# Altium schematic sheet motor2_control.SchDoc
size B; SheetNumber: 4; SheetTotal: 4
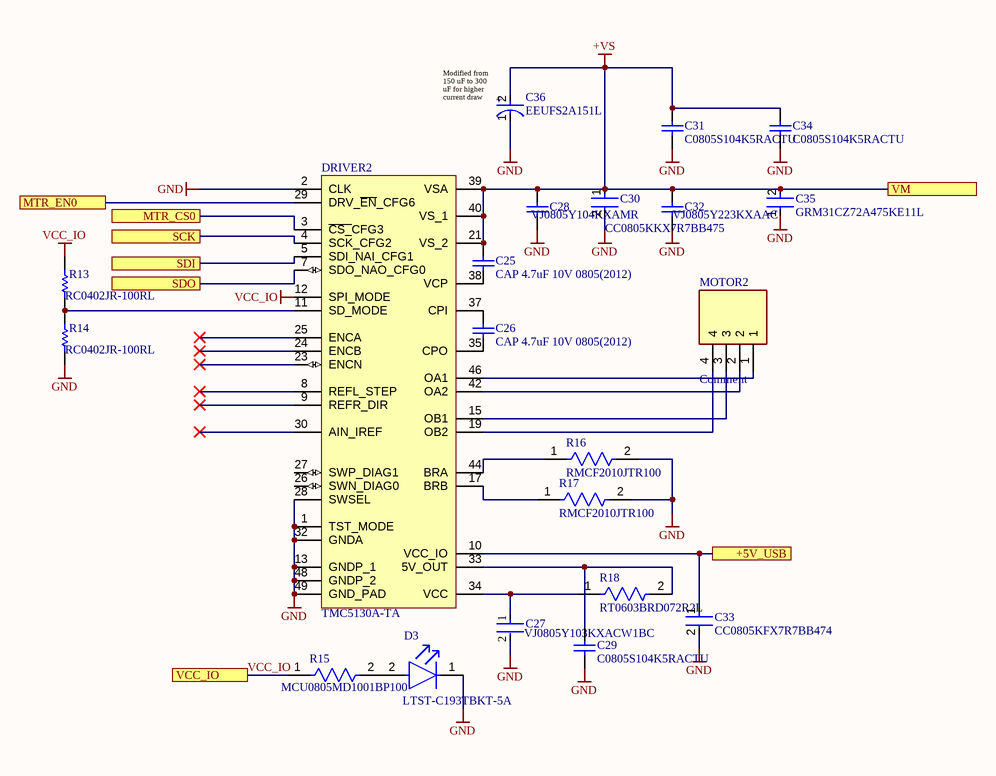
[diagram p0: motor2_control.SchDoc]

## Parts
C25  CAP 4.7uF 10V 0805(2012)  [CAPC0805(2012)155_L]
C26  CAP 4.7uF 10V 0805(2012)  [CAPC0805(2012)155_L]
C27  VJ0805Y103KXACW1BC  [FP-VJ0805-MFG]
C28  VJ0805Y104KXAMR  [CAPC2013X145X48NL20T23]
C29  C0805S104K5RACTU  [CAPC2013X145X50NL20T25]
C30  CC0805KKX7R7BB475  [FP-CC0805-0_85-MFG]
C31  C0805S104K5RACTU  [CAPC2013X145X50NL20T25]
C32  VJ0805Y223KXAAC  [CAPC2013X145X48NL20T23]
C33  CC0805KFX7R7BB474  [FP-CC0805-0_85-MFG]
C34  C0805S104K5RACTU  [CAPC2013X145X50NL20T25]
C35  GRM31CZ72A475KE11L  [FP-GRM31C-0_3-e0_3_0_9-MFG]
C36  EEUFS2A151L  [FP-RAD-TH-D_10_0_5-L_25_2-MFG]
D3  LTST-C193TBKT-5A  [FP-LTST-C193TBKT-5A-MFG]
DRIVER2  TMC5130A-TA  [TMC5130_TQFP48-EP_0.5_7.0X7.0]
MOTOR2  Comment  [TE_282834-4]
R13  RC0402JR-100RL  [RESC1005X40X25NL05T10]
R14  RC0402JR-100RL  [RESC1005X40X25NL05T10]
R15  MCU0805MD1001BP100  [FP-MCU0805-IPC_A]
R16  RMCF2010JTR100  [FP-RMCF2010-IPC_B]
R17  RMCF2010JTR100  [FP-RMCF2010-IPC_B]
R18  RT0603BRD072R2L  [FP-RT0603-MFG]

## Ports
+5V_USB, MTR_CS0, MTR_EN0, SCK, SDI, SDO, VCC_IO, VM

## Nets
+VS: C25.2 C28.2 C30.1 C31.2 C32.2 C34.2 C35.2 C36.2(A) DRIVER2.21(VS_2) DRIVER2.39(VSA) DRIVER2.40(VS_1) ; port VM
GND: C27.2 C28.1 C29.1 C30.2 C31.1 C32.1 C33.2 C34.1 C35.1 C36.1(C) D3.1(C) DRIVER2.1(TST_MODE) DRIVER2.2(CLK) DRIVER2.13(GNDP_1) DRIVER2.28(SWSEL) DRIVER2.32(GNDA) DRIVER2.48(GNDP_2) DRIVER2.49(GND_PAD) R14.2 R16.2 R17.2
VCC_IO: DRIVER2.12(SPI_MODE) R13.1 R15.1 ; port VCC_IO
+5V_USB: C33.1 DRIVER2.10(VCC_IO) ; port +5V_USB
MTR_CS0: DRIVER2.3(~{CS_}CFG3) ; port MTR_CS0
MTR_EN0: DRIVER2.29(DRV_~{EN}_CFG6) ; port MTR_EN0
SCK: DRIVER2.4(SCK_CFG2) ; port SCK
SDI: DRIVER2.5(SDI_NAI_CFG1) ; port SDI
SDO: DRIVER2.7(SDO_NAO_CFG0) ; port SDO
NetC25_1: C25.1 DRIVER2.38(VCP)
NetC26_1: C26.1 DRIVER2.35(CPO)
NetC26_2: C26.2 DRIVER2.37(CPI)
NetC27_1: C27.1 DRIVER2.34(VCC) R18.1
NetC29_2: C29.2 DRIVER2.33(5V_OUT) R18.2
NetD3_2: D3.2(A) R15.2
NetDRIVER2_11: DRIVER2.11(SD_MODE) R13.2 R14.1
NetDRIVER2_15: DRIVER2.15(OB1) MOTOR2.3
NetDRIVER2_17: DRIVER2.17(BRB) R17.1
NetDRIVER2_19: DRIVER2.19(OB2) MOTOR2.4
NetDRIVER2_42: DRIVER2.42(OA2) MOTOR2.2
NetDRIVER2_44: DRIVER2.44(BRA) R16.1
NetDRIVER2_46: DRIVER2.46(OA1) MOTOR2.1

Not connected (* = marked no-connect by the designer): DRIVER2 8(REFL_STEP)* 9(REFR_DIR)* 23(ENCN)* 24(ENCB)* 25(ENCA)* 26(SWN_DIAG0) 27(SWP_DIAG1) 30(AIN_IREF)*

## Notes on the sheet
- (near C36) Modified from 150 uF to 300 uF for higher current draw
- (in symbol CMP-05427-000502-1) +

## Library data of the parts
C25 C26 = CMP-1036-04882-1: CAP 4.7uF 10V ±10% 0805 (2012 Metric) Thickness 1.55mm SMD; Case-EIA: 0805; Tolerance: Â±10%; Case-Metric: 2012; Rated Voltage: 10 V; Max Thickness: 1.55 mm; Technology: SMT; Value: 4.7uF
C27 = CMP-2007-03438-2: NexarPartId: 39476146; Dielectric: X7R; Tolerance: 10%; Voltage: 50V; Dielectric Material: Tantalum; Capacitance: 10nF; Case Code (Imperial): 0805; Case Code (Metric): 2012; Schedule B: 8532240020, 8532240020; Radiation Hardening: No; Packaging: Cut Tape; Thickness: 939.8µm; Width: 1.2446mm; Lead Free: Lead Free; RoHS: Compliant; Depth: 1.25mm; Number of Pins: 2; Mount: Surface Mount; Case/Package: 0805; Length: 2mm; Termination: SMD/SMT; Max Operating Temperature: 125°C; REACH SVHC: Unknown; Min Operating Temperature: -55°C; Voltage Rating: 50V; Height: 1.45mm; Voltage Rating (DC): 50V
C28 = CMP-2007-01705-1: Manufacturer: Vitramon; Part Number: VJ0805Y104KXAMR
C29 C31 C34 = CMP-2007-01227-1: Manufacturer: Kemet; Part Number: C0805S104K5RACTU
C30 = CMP-03422-000207-1: CAP CER 4.7UF 16V X7R 0805; Manufacturer: Yageo; Tolerance: 0.1; Material: Ceramic; Footprint Url: http://www.yageo.com/exep/pages/download/literatures/UPY-C_GEN_24.pdf; Device Class L3: Ceramic Capacitors; Temperature: -30°C to +85°C; Device Class L2: Capacitors; Automotive: No; Digikey Description: CAP CER 4.7UF 16V X7R 0805; Temperature Range High: +85°C; Lead Free: Yes; Mouser Description: Multilayer Ceramic Capacitors MLCC - SMD/SMT 4.7M pF 10% 16 Volts; Temperature Characteristic: X7R; Height: 0.95mm; Device Class L1: Passive Components; ComponentLink2Description: Datasheet; Category: Cap; Octopart: https://octopart.com/cc0805kkx7r7bb475-yageo-34429188; Temperature Range Low: -30°C; Manufacturer Part Number: CC0805KKX7R7BB475; Package: CC0805-0.85; Ipc Land Pattern Name: CAPC200125X85; RoHS: TRUE; Value: 4.7 uF; Capacitance: 4.7 uF; ComponentLink2URL: http://www.yageo.com/documents/recent/UPY-GPHC_Y5V_6.3V-to-50V_8.pdf; Voltage Rating: 16 V
C32 = CMP-2007-01723-1: Manufacturer: Vitramon; Part Number: VJ0805Y223KXAAC
C33 = CMP-03422-001203-1: CC0805 470 nF X7R 10.00% 16 V; Manufacturer: Yageo; Tolerance: 0.1; Voltage Rating: 16 V; Value: 470 nF; Material: Ceramic; Device Class L1: Passive Components; Footprint Url: http://www.yageo.com/exep/pages/download/literatures/UPY-C_GEN_24.pdf; Temperature Range Low: -30°C; Octopart: https://octopart.com/cc0805kfx7r7bb474-yageo-24732839; Temperature Range High: +85°C; Mouser Description: Multilayer Ceramic Capacitors MLCC - SMD/SMT 470nF 16V X7R 10%; Height: 0.95mm; Manufacturer Part Number: CC0805KFX7R7BB474; Device Class L3: Ceramic Capacitors; Automotive: No; RoHS: TRUE; Temperature: -30°C to +85°C; Lead Free: Yes; ComponentLink2URL: http://www.yageo.com/documents/recent/UPY-GPHC_Y5V_6.3V-to-50V_8.pdf; Device Class L2: Capacitors; Temperature Characteristic: X7R; ComponentLink2Description: Datasheet; Ipc Land Pattern Name: CAPC200125X85; Package: CC0805-0.85; Capacitance: 470 nF; Category: Cap
C35 = CMP-06035-056253-1: Chip Multilayer Ceramic Capacitors for General Purpose, 1206, 4.7uF, X7R, 15%, 10%, 100V
C36 = CMP-05427-000502-1: Aluminum Electrolytic Capacitors (Radial Lead Type) 150uF ±20% 100V; RoHS Compliant: Yes
D3 = CMP-2000-06624-2: LED BLUE CLEAR CHIP SMD; Number of Elements: 1; Forward Voltage: 2.8V; Forward Current: 20mA; Test Current: 5mA; Lens Color: Colorless; Dominant Wavelength: 475nm; Reverse Voltage: 5V; Viewing Angle: 130°; Lens Style: Diffused; Luminous Intensity: 15mcd; Power Dissipation: 76mW; Max Operating Temperature: 80°C; Length: 1.6mm; Number of LEDs: 1; Case/Package: 0603; Case Code (Metric): 1608; Number of Pins: 2; Radiation Hardening: No; Min Operating Temperature: -20°C; Width: 0.8mm; Packaging: Tape and Reel; Package Quantity: 1; Lead Free: Lead Free; Lens Transparency: Clear; Illumination Color: Blue; Color: Blue; RoHS Compliant: Yes; Mount: Surface Mount; Depth: 0.8mm; Case Code (Imperial): 0603; Height: 0.35mm
DRIVER2 = TMC5130A-TA: High voltage(up to 46V) controller for two-phase bipolar stepper motor, with SPI, Step/Dir, UART, TQFP48-EP(7x7); Manufacturer: TRINAMIC; Geometry.Height: 1,2mm; Ordercode - Distri#1: 1460-1124-ND; Datasheet: http://www.trinamic.com/_scripts/download.php?file=_articles%2Fproducts%2Fintegrated-circuits%2Ftmc5130%2F_datasheet%2FTMC5130_datasheet.pdf; Distributor#1: Digikey; Distributor#2: *; Ordercode - Distri#2: *; Ordercode - Manu#1: TMC5130A-TA; Value: TMC5130A-TA; MPN: TMC5130A-TA; MF: TRINAMIC
MOTOR2 = 282834-4: Conn; Term Blk; PCB; Wire Receptacle; 4; 2.54mm; 30-16AWG; Green; 10A;150V; M1.6 | TE Connectivity 282834-4; Number_of_Positions: 4; Centerline_Pitch: 2.54 mm[.1 in]; SnapEDA_Link: https://www.snapeda.com/parts/282834-4/TE+Connectivity+AMP+Connectors/view-part/?ref=snap; Package: None; Value: *; MF: TE Connectivity; MP: 282834-4; EU_RoHS_Compliance: Compliant with Exemptions; Check_prices: https://www.snapeda.com/parts/282834-4/TE+Connectivity+AMP+Connectors/view-part/?ref=eda
R13 R14 = CMP-2002-06970-1: Manufacturer: Yageo; Part Number: RC0402JR-100RL
R15 = CMP-02407-000288-1: RES 1.05K OHM 0.5% 1/5W 0805; Tolerance: 0.1%; Resistance: 1kR; Power Rating: 200mW; Voltage Rating: 150V; Max Operating Temperature: 155°C; Width: 1.25mm; Min Operating Temperature: -55°C; Case Code (Metric): 2012; Packaging: Tape and Reel; Case Code (Imperial): 0805; Length: 2mm; Height: 0.52mm; Case/Package: 0805; Weight: 0.000162oz; Composition: Thin Film
R16 R17 = CMP-26527-004988-1: 0.1Ω ±5% 0.75W 2010 Thick Film Chip Resistor AEC-Q200 compliant; Resistance: 100mR; Max Power Dissipation: 750mW; Temperature Coefficient: 200ppm/°C; Width: 0.098inch; Construction: Rectangular; Case Code (Imperial): 2010; Number of Terminations: 2; Case/Package: 0201; Series: RMCF; Mount: Surface Mount; Resistor Type: Thick Film; Military Standard: Not; Height: 0.028inch; Tolerance: 5%; Depth: 0.3mm; Contact Plating: Tin; Length: 0.197inch; Max Operating Temperature: 155°C; Radiation Hardening: No; Min Operating Temperature: -55°C; Case Code (Metric): 5025; Features: Automotive AEC-Q200; RoHS Compliant: Yes; Packaging: Tape and Reel
R18 = CMP-03412-032977-1: RT0603 2.2Ω 0.1W 25 ppm/°C 0.10%; Manufacturer: Yageo; Voltage Rating: 75V; Tolerance: 0.001; Octopart: https://octopart.com/rt0603brd072r2l-yageo-80827805; Temperature: -55°C to +155°C; Category: Res; Temperature Range High: +155°C; Device Class L2: Resistors; Value: 2.2Ω; Composition: Thin Film; Ipc Land Pattern Name: RESC16080X45; Temperature Range Low: -55°C; Footprint Url: http://www.yageo.com/exep/pages/download/literatures/PYu-R_Mount_10.pdf; Resistance: 2.2Ω; Package: RT0603; Automotive: No; Power Rating: 0.1W; Manufacturer Part Number: RT0603BRD072R2L; Lead Free: Yes; RoHS: TRUE; Series: RT; Device Class L3: Chip SMD Resistors; Height: 0.55mm; Temperature Coefficient: 25 ppm/°C; ComponentLink2Description: Datasheet; ComponentLink2URL: http://www.yageo.com/documents/recent/PYu-RT_1-to-0.01_RoHS_L_9.pdf; Device Class L1: Passive Components